# Altium project PCB_design_3.PrjPcb
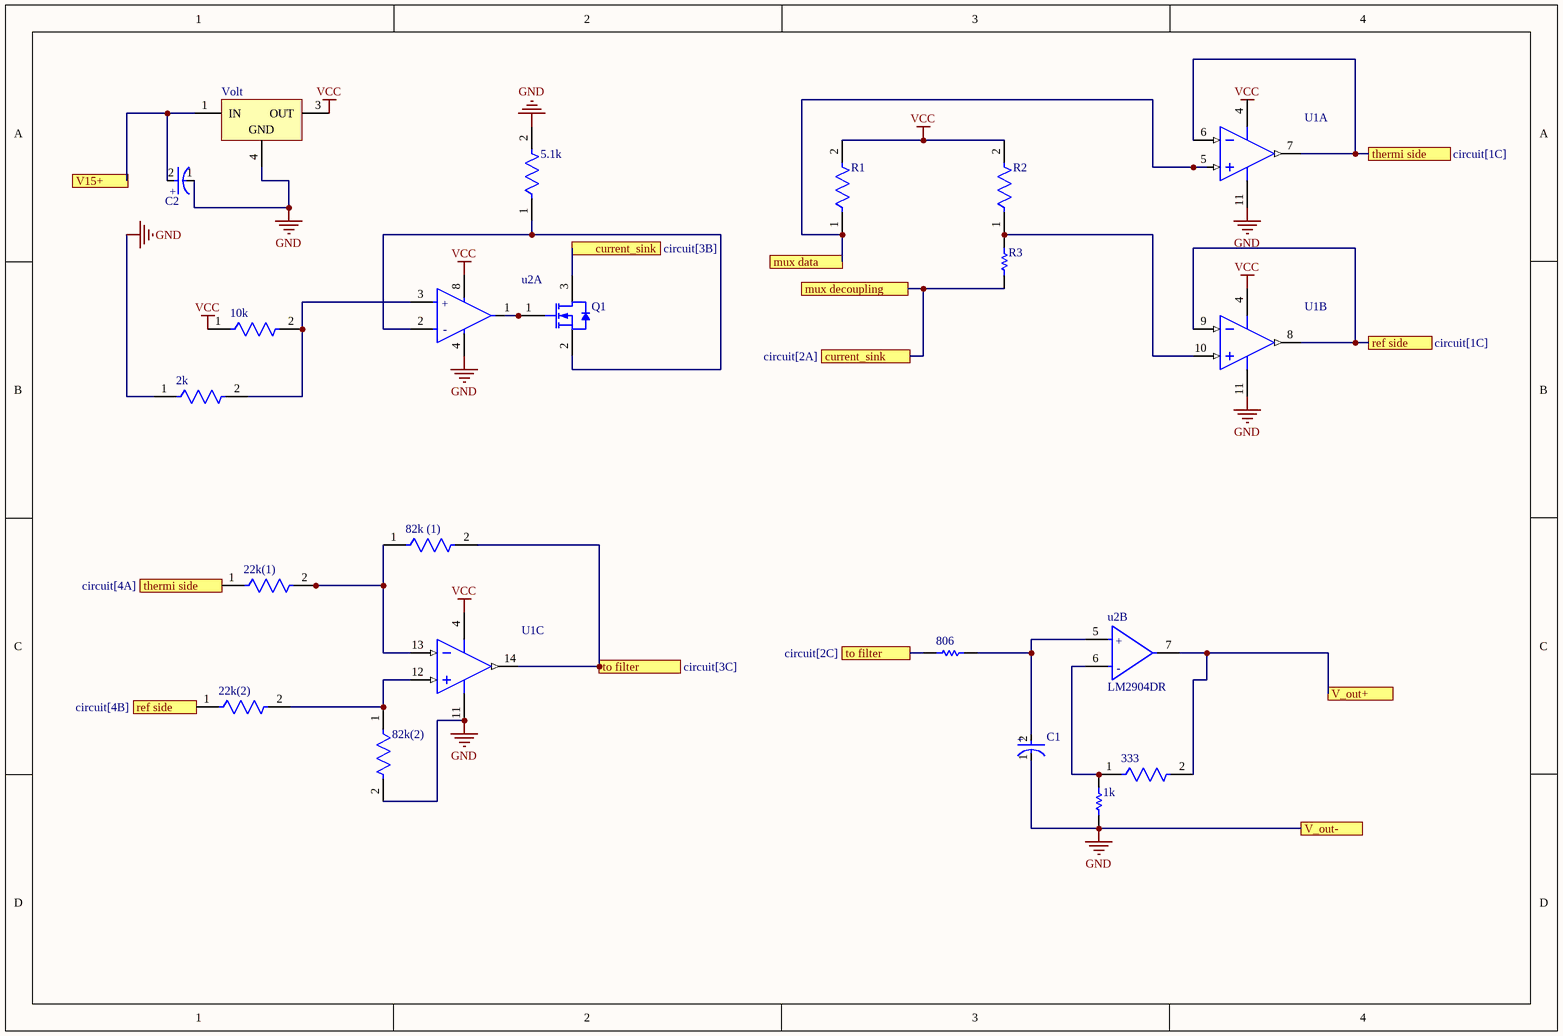
[diagram p0: circuit.SchDoc]
5 sheets, 94 parts. Net scope: flat (ports and power ports of the same name join across sheets).
Board files: circuit_pcb.PcbDoc, mounting_pcb.PcbDoc
Sheets:
  circuit.SchDoc
  mounting_circuit.SchDoc
  mounting_circuit(2).SchDoc
  mounting_circuit(3).SchDoc
  mounting_circuit(4).SchDoc

## Sheet circuit.SchDoc
size A4; SheetNumber: 1; SheetTotal: 5

### Parts
1k  CRCW12101K00FKEAHP  [RESC3225X60X45NL20T20]  (value not drawn)
2k  CRCW12062K00FKEA  [FP-CRCW1206-e3-IPC_A]  (value not drawn)
5.1k  CRCW12065K10FKEA  [FP-CRCW1206-e3-IPC_C]  (value not drawn)
10k  CRCW120610K0FKEA  [FP-CRCW1206-e3-IPC_C]  (value not drawn)
22k(1)  CRCW120622K0FKEA  [FP-CRCW1206-e3-IPC_A]  (value not drawn)
22k(2)  CRCW120622K0FKEA  [FP-CRCW1206-e3-IPC_A]  (value not drawn)
82k(2)  CRCW120682K0FKEA  [FP-CRCW1206-e3-IPC_B]  (value not drawn)
82k_(1)  CRCW120682K0FKEA  [FP-CRCW1206-e3-IPC_B]  (value not drawn)
333  CRCW0603330RFKEAHP  [FP-CRCW0603-HPe3-IPC_C]  (value not drawn)
806  RC1206FR-07806RL  [RESC3116X65X40NL10T20]  (value not drawn)
C1  TAJA106K016RNJ  [FP-TAJA-MFG]  (value not drawn)
C2  TAJA106K016RNJ  [FP-TAJA-MFG]  (value not drawn)
Q1  MGSF1N02LT1G  [ONSC-SOT-23-3-318-08_V]  (value not drawn)
R1  CRCW080540K0FKEA  [FP-CRCW0805-e3-MFG]  (value not drawn)
R2  CRCW080540K0FKEA  [FP-CRCW0805-e3-MFG]  (value not drawn)
R3  CRCW120615K0FKEA  [RESC3216X60X45LL10T20]  (value not drawn)
U1  LMH6683MA/NOPB  [D0014A_M]  (value not drawn)  (parts A,B,C of 4)
u2  LM2904DR  [FP-D0008A-MFG]  (value not drawn)  (parts A,B of 2)
Volt  L7812CD2T-TR  [TO-263_M]  (value not drawn)

### Ports
current_sink (see circuit[2A]), current_sink (see circuit[3B]), mux data, mux decoupling, ref side (see circuit[1C]), ref side (see circuit[4B]), thermi side (see circuit[1C]), thermi side (see circuit[4A]), to filter (see circuit[2C]), to filter (see circuit[3C]), V15+, V_out+, V_out-

### Nets
GND: 1k.1 2k.1 5.1k.2 82k(2).2 C1.1(C) C2.1(C) U1.11(V-) u2.4(V-) Volt.4(GND) ; port V_out-
VCC: 10k.1 R1.2 R2.2 U1.4(V+) u2.8(V+) Volt.3(OUT)
Net1k_2: 1k.2 333.1 u2.6(IN2-)
Net2k_2: 2k.2 10k.2 u2.3(IN1+)
Net5.1k_1: 5.1k.1 Q1.2(S) u2.2(IN1-)
Net22k(1)_1: 22k(1).1 U1.6(IN1-) U1.7(OUT1) ; port thermi side
Net22k(1)_2: 22k(1).2 82k_(1).1 U1.13(IN3-)
Net22k(2)_1: 22k(2).1 U1.8(OUT2) U1.9(IN2-) ; port ref side
Net22k(2)_2: 22k(2).2 82k(2).1 U1.12(IN3+)
Net82k_(1)_2: 82k_(1).2 806.1 U1.14(OUT3) ; port to filter
Net333_2: 333.2 u2.7(OUT2) ; port V_out+
Net806_2: 806.2 C1.2(A) u2.5(IN2+)
NetC2_2: C2.2(A) Volt.1(IN)
NetQ1_1: Q1.1(G) u2.1(OUT1)
NetQ1_3: Q1.3(D) R3.1 ; port current_sink, port mux decoupling
NetR1_1: R1.1 U1.5(IN1+) ; port mux data
NetR2_1: R2.1 R3.2 U1.10(IN2+)

### Notes on the sheet
- Labels drawn without touching a wire or pin: VCC
- (in symbol CMP-1661-00004-2) +
- (in symbol CMP-04895-000052-2, part A) +; -
- (in symbol CMP-04895-000052-2, part B) +; -

### Library data of the parts
1k = CMP-2005-00195-1: Manufacturer: Vishay Dale; Part Number: CRCW12101K00FKEAHP
2k = CMP-1014-00542-3: RES Thick Film, 2kΩ, 1%, 0.25W, 100ppm/°C, 1206; Max Power Dissipation: 250mW; Voltage Rating: 200V; Resistance: 2kR; Package Quantity: 10; Height: 0.55mm; Tolerance: 1%; Number of Terminations: 2; Mount: Surface Mount; Width: 1.6mm; Length: 3.2mm; Features: Automotive AEC-Q200; Contact Plating: Tin; Number of Pins: 2; Weight: 0.000353oz; Max Operating Temperature: 155°C; Min Operating Temperature: -55°C; Termination: SMD/SMT; Temperature Coefficient: 100ppm/°C; Case Code (Imperial): 1206; Depth: 1.6mm; Military Standard: Not; Case Code (Metric): 3216; Composition: Thick Film; Power Rating: 250mW; Case/Package: 1206; Radiation Hardening: No; Packaging: Tape and Reel
5.1k = CMP-1014-00590-3: RES Thick Film, 5.1kΩ, 1%, 0.25W, 100ppm/°C, 1206; Voltage Rating (DC): 200V; Max Power Dissipation: 250mW; Resistance: 5.1kR; Features: Automotive AEC-Q200; Weight: 0.000353oz; Case Code (Imperial): 1206; Case/Package: 1206; Min Operating Temperature: -55°C; Max Operating Temperature: 155°C; Height: 0.55mm; Termination: SMD/SMT; Case Code (Metric): 3216; Power Rating: 250mW; Lead Free: Lead Free; Contact Plating: Tin; Tolerance: 1%; Depth: 1.6mm; Composition: Thick Film; Radiation Hardening: No; Military Standard: Not; Packaging: Tape and Reel; Width: 1.6mm; Voltage Rating: 200V; Package Quantity: 10; Temperature Coefficient: 100ppm/°C; Length: 3.2mm; Number of Terminations: 2
10k = CMP-2003-04807-2: RES Thick Film, 10kΩ, 1%, 0.25W, 100ppm/°C, 1206; Working Voltage: 200V; Max Power Dissipation: 250mW; Resistance: 10kR; Tolerance: 1%; Width: 0.063inch; Height: 0.55mm; Number of Pins: 2; Voltage Rating: 200V; Temperature Coefficient: 100ppm/°C; Military Standard: Not; Features: Automotive AEC-Q200; Depth: 1.6mm; Radiation Hardening: No; Termination: SMD/SMT; Case Code (Imperial): 1206; Weight: 0.000353oz; Length: 3.2mm; Package Quantity: 10; Voltage Rating (DC): 200V; Case/Package: 1206; Min Operating Temperature: -55°C; Number of Terminations: 2; Composition: Thick Film; Contact Plating: Tin; Power Rating: 250mW; Packaging: Tape and Reel; Max Operating Temperature: 155°C; Lead Free: Lead Free; Case Code (Metric): 3216
22k(1) 22k(2) = CMP-2003-01962-2: RES Thick Film, 22kΩ, 1%, 0.25W, 100ppm/°C, 1206; Voltage Rating (DC): 200V; Resistance: 22kR; Max Power Dissipation: 250mW; Lead Free: Lead Free; Length: 3.2mm; Case Code (Imperial): 1206; Max Operating Temperature: 155°C; Packaging: Tape and Reel; Composition: Thick Film; Temperature Coefficient: 100ppm/°C; Contact Plating: Tin; Number of Terminations: 2; Case Code (Metric): 3216; Tolerance: 1%; Weight: 0.000353oz; Features: Automotive AEC-Q200; Min Operating Temperature: -55°C; Width: 0.063inch; Package Quantity: 10; Case/Package: 1206; Termination: SMD/SMT; Military Standard: Not; Depth: 1.6mm; Voltage Rating: 200V; Radiation Hardening: No; Power Rating: 250mW; Height: 0.55mm
82k(2) 82k_(1) = CMP-2003-02402-2: RES Thick Film, 82kΩ, 1%, 0.25W, 100ppm/°C, 1206; Max Power Dissipation: 250mW; Working Voltage: 200V; Resistance: 82kR; Temperature Coefficient: 100ppm/°C; Max Operating Temperature: 155°C; Depth: 1.6mm; Military Standard: Not; Case/Package: 1206; Number of Terminations: 2; Number of Pins: 2; Power Rating: 250mW; Packaging: Tape and Reel; Package Quantity: 10; Width: 0.063inch; Case Code (Imperial): 1206; Height: 0.55mm; Min Operating Temperature: -55°C; Termination: SMD/SMT; Tolerance: 1%; Voltage Rating (DC): 200V; Weight: 0.000353oz; Composition: Thick Film; Case Code (Metric): 3216; Contact Plating: Tin; Radiation Hardening: No; Lead Free: Lead Free; Voltage Rating: 200V; Features: Automotive AEC-Q200; Length: 3.2mm
333 = CMP-02407-011024-1: RES Thick Film, 330Ω, 1%, 0.33W, 100ppm/°C, 0603; Voltage Rating (DC): 75V; Resistance: 330R; Max Power Dissipation: 250mW; Length: 1.6mm; Case/Package: 0603; Depth: 0.85mm; Contact Plating: Tin; Resistor Type: Thick Film; Number of Terminations: 2; Height: 0.45mm; Radiation Hardening: No; Case Code (Imperial): 0603; Width: 0.033inch; Packaging: Tape and Reel; Weight: 7.1E-05oz; Lead Free: Lead Free; Technology: THICK FILM; Features: Automotive AEC-Q200; Resistance Tolerance: 1%; Tolerance: 1%; Termination: SMD/SMT; Max Operating Temperature: 155°C; RoHS Compliant: Yes; Mount: Surface Mount; Power Rating: 250mW; Series: CRCW-HP; Military Standard: Not; Voltage Rating: 75V; Package Quantity: 1; Temperature Coefficient: 100ppm/°C; Construction: Rectangular; Case Code (Metric): 1608; Min Operating Temperature: -55°C
806 = CMP-2003-03876-1: Manufacturer: Yageo; Part Number: RC1206FR-07806RL
C1 C2 = CMP-1661-00004-2: 10uF 16V  ±10% 3Ω 1206  SMD Tantalum Capacitor; ESR (Equivalent Series Resistance): 3R; Leakage Current: 1.6uA; Dissipation Factor: 8%; Polarity: Polar; Length: 3.2mm; Features: General Purpose; Voltage Rating: 16V; Voltage: 16V; Mount: Surface Mount; Case/Package: 1206; Number of Pins: 2; Case Code (Metric): 3216; Radiation Hardening: No; Min Operating Temperature: -55°C; Case Code (Imperial): 1206; Height - Seated (Max): 0.071inch; Lead Free: Lead Free; Termination: SMD/SMT; Dielectric Material: Tantalum; Width: 1.6mm; Tolerance: 10%; Capacitance: 10uF; Lead Pitch: 1.1mm; Max Operating Temperature: 125°C; Voltage Rating (DC): 16V; Packaging: Tape and Reel; Package Quantity: 1; REACH SVHC: No SVHC; Depth: 1.6mm; Height: 1.6mm
Q1 = CMP-1058-00777-1: Power MOSFET, 750 mA, 20 V, N-Channel, 3-Pin SOT-23, Pb-Free, Tape and Reel; Manufacturer: On Semiconductor; Crss Typ (pF): 45; Ciss Typ (pF): 125; VGS(th) Max (V): 2.4; Coss Typ (pF): 120; PD Max (W): 0.4; VGS Max (V): 20; Configuration: Single; Channel Polarity: N Channel; ID Max (A): 0.75; PackageReference: SOT-23-3-318-08; ComponentLink2Description: Datasheet; PackageVersion: Rev. AP, 11/2009; ComponentLink1URL: http://www.onsemi.com/; RoHS: Pb-Free; Mounting Technology: Surface Mount; Package Type: SOT-23-3; ComponentLink1Description: Manufacturer URL; V(BR)DSS Min (V): 20; PackageDescription: 3-Pin Small Outline Transistor, Body 2.92 x 1.3 mm, Pitch 0.95 mm; Packing: Tape and Reel; PartNumber: MGSF1N02LT1G; DatasheetVersion: Rev. 6; ComponentLink2URL: http://www.onsemi.cn/pub_link/Collateral/MGSF1N02LT1-D.PDF; ComponentLink3URL: http://www.onsemi.cn/pub_link/Collateral/318-08.PDF; ComponentLink3Description: Package Specification
R1 R2 = CMP-02407-003498-1: RES Thick Film, 40kΩ, 1%, 0.125W, 100ppm/°C, 0805; Resistance: 40kR; Max Power Dissipation: 125mW; Tolerance: 1%; Features: Automotive AEC-Q200; Max Operating Temperature: 155°C; Composition: Thick Film; Length: 0.079inch; Case/Package: 0805; Min Operating Temperature: -55°C; Packaging: Tape and Reel; Number of Terminations: 2; Width: 0.049inch; Height: 0.02inch; Package Quantity: 5000; Lead Free: Lead Free; Temperature Coefficient: 100ppm/°C
R3 = CMP-2003-01817-1: Manufacturer: Vishay Dale; Part Number: CRCW120615K0FKEA
U1 = CMP-0055-00500-3: 190MHz Single Supply, Dual and Triple Operational Amplifiers, 14-pin Narrow SOIC, Pb-Free; Manufacturer: Texas Instruments; PowerWise: N; PackageTopMarking: NSUZXYTTE#*LMH66*83MA; ComponentLink1Description: Datasheet URL; Package Reference: D0014A; PackageDescription: Molded Package S.O., .150in Wide, 14 Lead; CompType: Amplifiers; Code_JEDEC: MS-012AB; RoHS: Y; Code_IPC: SOIC127P600-14; ComponentLink1URL: http://www.ti.com/general/docs/lit/getliterature.tsp?genericPartNumber=LMH6683&fileType=pdf; PinCount: 14
u2 = CMP-04895-000052-2: IC OPAMP GP 2 CIRCUIT 8SOIC; Manufacturer: Texas Instruments; Max Supply Voltage: 26V; Nominal Supply Current: 350-500uA; Number Of Channels: 2; Input Offset Voltage: 3mV; Max Dual Supply Voltage: 13V; Max Junction Temp: +150°C; Voltage Gain: 100V/mV; Standoff Height: 0.11mm; Output Current Per Channel: 20mA; Gain Bandwidth: 0.7MHz; Min Dual Supply Voltage: 1.5V; Input Bias Current: -0.02uA; Min Supply Voltage: 3V; RoHS: TRUE; ComponentLink2URL: https://www.ti.com/lit/ds/symlink/lm2904.pdf; Category: IC; Ambient Temperature Range High: +125°C; Digikey Description: IC OPAMP GP 2 CIRCUIT 8SOIC; Automotive: No; Temperature Range High: +125°C; ComponentLink2Description: Datasheet; Mouser Description: Operational Amplifiers - Op Amps Dual GP Op Amp; Lead Free: Yes; Temperature: -40°C to +125°C; Manufacturer Part Number: LM2904DR; Device Class L3: Amplifiers - Op Amps; Device Class L2: Linear ICs; Device Class L1: Integrated Circuits (ICs); Package: D0008A; Octopart: https://octopart.com/lm2904dr-texas+instruments-409181; Height: 1.75mm; Ambient Temperature Range Low: -40°C; Temperature Range Low: -40°C
Volt = CMP-0244-00182-1: Positive Voltage Regulator, 3-Pin D2PAK, Tape and Reel; PackageDescription: 3-Pin Transistor Outline Package 2.54 mm Pitch, 15.4 mm Lead Span (D2PAK); ComponentLink1Description: Manufacturer URL; PackageReference: TO-263; DatasheetVersion: 16/11/2011; ComponentLink2URL: http://www.st.com/internet/com/TECHNICAL_RESOURCES/TECHNICAL_LITERATURE/DATASHEET/CD00000444.pdf; ComponentLink1URL: http://www.st.com; PackageVersion: 2011; ComponentLink2Description: Datasheet

## Sheet mounting_circuit.SchDoc
size A4; SheetNumber: 2; SheetTotal: 5
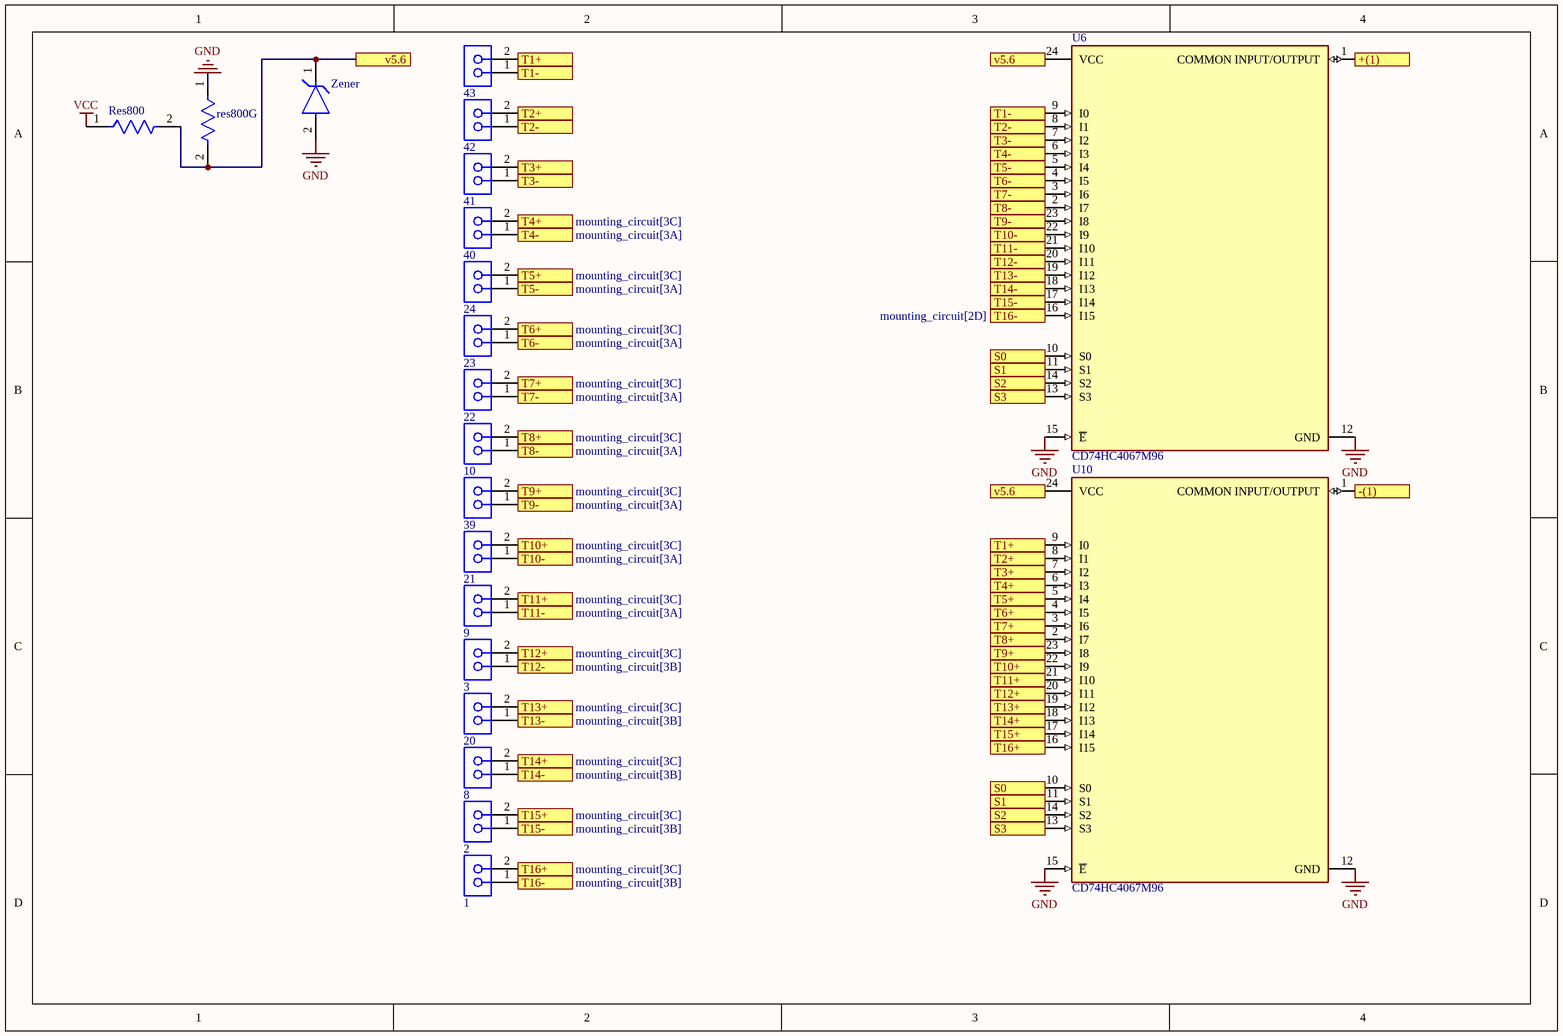
[diagram p1: mounting_circuit.SchDoc]

### Parts
1  Comment  [SMTC-SSW-102-02-X-S]  (value not drawn)
2  Comment  [SMTC-SSW-102-02-X-S]  (value not drawn)
3  Comment  [SMTC-SSW-102-02-X-S]  (value not drawn)
8  Comment  [SMTC-SSW-102-02-X-S]  (value not drawn)
9  1  [SMTC-SSW-102-02-X-S]  (value not drawn)
10  Comment  [SMTC-SSW-102-02-X-S]  (value not drawn)
20  Comment  [SMTC-SSW-102-02-X-S]  (value not drawn)
21  Comment  [SMTC-SSW-102-02-X-S]  (value not drawn)
22  Comment  [SMTC-SSW-102-02-X-S]  (value not drawn)
23  Comment  [SMTC-SSW-102-02-X-S]  (value not drawn)
24  0  [SMTC-SSW-102-02-X-S]  (value not drawn)
39  Comment  [SMTC-SSW-102-02-X-S]  (value not drawn)
40  0  [SMTC-SSW-102-02-X-S]  (value not drawn)
41  Comment  [SMTC-SSW-102-02-X-S]  (value not drawn)
42  Comment  [SMTC-SSW-102-02-X-S]  (value not drawn)
43  Comment  [SMTC-SSW-102-02-X-S]  (value not drawn)
Res800  MCA12060D8000BP500  [FP-MCA1206-IPC_C]  (value not drawn)
res800G  MCA12060D8000BP500  [FP-MCA1206-IPC_C]  (value not drawn)
U6  CD74HC4067M96  [FP-DW0024A-MFG]
U10  CD74HC4067M96  [FP-DW0024A-MFG]
Zener  MM3Z5V6ST1G  [FP-477-02-MFG]  (value not drawn)

### Ports
+(1), -(1), S0 (see mounting_circuit(2)[2B], mounting_circuit(2)[2D], mounting_circuit(3)[2B], mounting_circuit(3)[2D], mounting_circuit[3B]), S0 (see mounting_circuit(2)[2B], mounting_circuit(2)[2D], mounting_circuit(3)[2B], mounting_circuit(3)[2D], mounting_circuit[3D]), S1 (see mounting_circuit(2)[2B], mounting_circuit(2)[2D], mounting_circuit(3)[2B], mounting_circuit(3)[2D], mounting_circuit[3B]), S1 (see mounting_circuit(2)[2B], mounting_circuit(2)[2D], mounting_circuit(3)[2B], mounting_circuit(3)[2D], mounting_circuit[3D]), S2 (see mounting_circuit(2)[2B], mounting_circuit(2)[2D], mounting_circuit(3)[2B], mounting_circuit(3)[2D], mounting_circuit[3B]), S2 (see mounting_circuit(2)[2B], mounting_circuit(2)[2D], mounting_circuit(3)[2B], mounting_circuit(3)[2D], mounting_circuit[3D]), S3 (see mounting_circuit(2)[2B], mounting_circuit(2)[2D], mounting_circuit(3)[2B], mounting_circuit(3)[2D], mounting_circuit[3B]), S3 (see mounting_circuit(2)[2B], mounting_circuit(2)[2D], mounting_circuit(3)[2B], mounting_circuit(3)[2D], mounting_circuit[3D]), T1+ (see mounting_circuit[2A]), T1+ (see mounting_circuit[3C]), T1- (see mounting_circuit[2A]), T1- (see mounting_circuit[3A]), T2+ (see mounting_circuit[2A]), T2+ (see mounting_circuit[3C]), T2- (see mounting_circuit[2A]), T2- (see mounting_circuit[3A]), T3+ (see mounting_circuit[2A]), T3+ (see mounting_circuit[3C]), T3- (see mounting_circuit[2A]), T3- (see mounting_circuit[3A]), T4+ (see mounting_circuit[2A]), T4+ (see mounting_circuit[3C]), T4- (see mounting_circuit[2A]), T4- (see mounting_circuit[3A]), T5+ (see mounting_circuit[2B]), T5+ (see mounting_circuit[3C]), T5- (see mounting_circuit[2B]), T5- (see mounting_circuit[3A]), T6+ (see mounting_circuit[2B]), T6+ (see mounting_circuit[3C]), T6- (see mounting_circuit[2B]), T6- (see mounting_circuit[3A]), T7+ (see mounting_circuit[2B]), T7+ (see mounting_circuit[3C]), T7- (see mounting_circuit[2B]), T7- (see mounting_circuit[3A]), T8+ (see mounting_circuit[2B]), T8+ (see mounting_circuit[3C]), T8- (see mounting_circuit[2B]), T8- (see mounting_circuit[3A]), T9+ (see mounting_circuit[2B]), T9+ (see mounting_circuit[3C]), T9- (see mounting_circuit[2B]), T9- (see mounting_circuit[3A]), T10+ (see mounting_circuit[2C]), T10+ (see mounting_circuit[3C]), T10- (see mounting_circuit[2C]), T10- (see mounting_circuit[3A]), T11+ (see mounting_circuit[2C]), T11+ (see mounting_circuit[3C]), T11- (see mounting_circuit[2C]), T11- (see mounting_circuit[3A]), T12+ (see mounting_circuit[2C]), T12+ (see mounting_circuit[3C]), T12- (see mounting_circuit[2C]), T12- (see mounting_circuit[3B]), T13+ (see mounting_circuit[2C]), T13+ (see mounting_circuit[3C]), T13- (see mounting_circuit[2C]), T13- (see mounting_circuit[3B]), T14+ (see mounting_circuit[2C]), T14+ (see mounting_circuit[3C]), T14- (see mounting_circuit[2D]), T14- (see mounting_circuit[3B]), T15+ (see mounting_circuit[2D]), T15+ (see mounting_circuit[3C]), T15- (see mounting_circuit[2D]), T15- (see mounting_circuit[3B]), T16+ (see mounting_circuit[2D]), T16+ (see mounting_circuit[3C]), T16- (see mounting_circuit[2D]), T16- (see mounting_circuit[3B]), v5.6 (see mounting_circuit(2)[2A], mounting_circuit(2)[2C], mounting_circuit(3)[2A], mounting_circuit(3)[2C], mounting_circuit(4)[2A], mounting_circuit(4)[2C], mounting_circuit[1A], mounting_circuit[3A]), v5.6 (see mounting_circuit(2)[2A], mounting_circuit(2)[2C], mounting_circuit(3)[2A], mounting_circuit(3)[2C], mounting_circuit(4)[2A], mounting_circuit(4)[2C], mounting_circuit[1A], mounting_circuit[3B]), v5.6 (see mounting_circuit(2)[2A], mounting_circuit(2)[2C], mounting_circuit(3)[2A], mounting_circuit(3)[2C], mounting_circuit(4)[2A], mounting_circuit(4)[2C], mounting_circuit[3A], mounting_circuit[3B])

### Nets
GND: res800G.1 U6.12(GND) U6.15(~{E}) U10.12(GND) U10.15(~{E}) Zener.2(A)
VCC: Res800.1
Net1_1: 1.1 U6.16(I15) ; port T16-
Net1_2: 1.2 U10.16(I15) ; port T16+
Net2_1: 2.1 U6.17(I14) ; port T15-
Net2_2: 2.2 U10.17(I14) ; port T15+
Net3_1: 3.1 U6.20(I11) ; port T12-
Net3_2: 3.2 U10.20(I11) ; port T12+
Net8_1: 8.1 U6.18(I13) ; port T14-
Net8_2: 8.2 U10.18(I13) ; port T14+
Net9_1: 9.1 U6.21(I10) ; port T11-
Net9_2: 9.2 U10.21(I10) ; port T11+
Net10_1: 10.1 U6.2(I7) ; port T8-
Net10_2: 10.2 U10.2(I7) ; port T8+
Net20_1: 20.1 U6.19(I12) ; port T13-
Net20_2: 20.2 U10.19(I12) ; port T13+
Net21_1: 21.1 U6.22(I9) ; port T10-
Net21_2: 21.2 U10.22(I9) ; port T10+
Net22_1: 22.1 U6.3(I6) ; port T7-
Net22_2: 22.2 U10.3(I6) ; port T7+
Net23_1: 23.1 U6.4(I5) ; port T6-
Net23_2: 23.2 U10.4(I5) ; port T6+
Net24_1: 24.1 U6.5(I4) ; port T5-
Net24_2: 24.2 U10.5(I4) ; port T5+
Net39_1: 39.1 U6.23(I8) ; port T9-
Net39_2: 39.2 U10.23(I8) ; port T9+
Net40_1: 40.1 U6.6(I3) ; port T4-
Net40_2: 40.2 U10.6(I3) ; port T4+
Net41_1: 41.1 U6.7(I2) ; port T3-
Net41_2: 41.2 U10.7(I2) ; port T3+
Net42_1: 42.1 U6.8(I1) ; port T2-
Net42_2: 42.2 U10.8(I1) ; port T2+
Net43_1: 43.1 U6.9(I0) ; port T1-
Net43_2: 43.2 U10.9(I0) ; port T1+
NetRes800_2: Res800.2 res800G.2 U6.24(VCC) U10.24(VCC) Zener.1(C) ; port v5.6
NetU4_10: U6.10(S0) U10.10(S0) ; port S0
NetU4_11: U6.11(S1) U10.11(S1) ; port S1
NetU4_13: U6.13(S3) U10.13(S3) ; port S3
NetU4_14: U6.14(S2) U10.14(S2) ; port S2
NetU6_1: U6.1(COMMON_INPUT/OUTPUT) ; port +(1)
NetU10_1: U10.1(COMMON_INPUT/OUTPUT) ; port -(1)

### Library data of the parts
1-3 8-10 20-24 39-43 = CMP-1023-00323-1: SQ Post Socket, Through-hole, Vertical, -55 to 105 degC, 2.54 mm Pitch, 2-Pin, Female, RoHS; Manufacturer: Samtec; PartNumber: SSW-102-02-T-S; Pitch: 2.54 mm; ComponentLink3Description: Package Specification; ComponentLink2Description: Datasheet; ComponentLink1Description: Manufacturer URL; PackageVersion: CA, 6/1987; DatasheetVersion: F-214; PackageDescription: Assembly, Socket Strip .016 X .031 Tail; ComponentLink2URL: http://www.samtec.com/documents/webfiles/pdf/SSW_TH.PDF; RoHS: True; ComponentLink3URL: http://www.samtec.com/documents/webfiles/cpdf/SSW-1XX-XX-XXX-X-XX-XXX-XX-MKT.pdf; ComponentLink1URL: http://www.samtec.com; PackageReference: SSW-102-02-X-S; Mounting Technology: Through-hole; Orientation: Vertical; Temperature Range: -55 to 105 degC
Res800 res800G = CMP-02407-008722-1: Res MC Precision Thin Film 1206 800Ω 0.1% 0.25W ±25ppm/°C Molded Paper T/R; Resistance: 800R; Max Power Dissipation: 250mW; Lead Free: Lead Free; Package Quantity: 5000; Composition: Thin Film; Tolerance: 0.1%; Number of Terminations: 2; Length: 0.126inch; Width: 0.063inch; Max Operating Temperature: 125°C; Packaging: Tape and Reel; Min Operating Temperature: -55°C; Case/Package: 1206; Temperature Coefficient: 25ppm/°C; Height: 0.026inch
U6 U10 = CMP-04901-000007-1: IC MUX/DEMUX 1X16 24SOIC; Manufacturer: Texas Instruments; Standoff Height: 0.1mm; Logic Function Desc: Non-Inverting; Max Supply Voltage: 6V; Number Of Inputs: 16; Quiescent Current: 8uA; Number Of Circuits: 1; Propagation Delay: 6ns; Max Junction Temp: +150°C; Min Supply Voltage: 2V; ComponentLink2Description: Datasheet; Octopart: https://octopart.com/cd74hc4067m96-texas+instruments-722802; Ambient Temperature Range High: +125°C; Ipc Land Pattern Name: SOIC127P1030X265-24; Height: 2.65mm; Mouser Description: Multiplexer Switch ICs Hi-Spd CMOS 16Ch Anl Mltplxr/Demltplxr; Temperature Range Low: -55°C; Package: DW0024A; Temperature Range High: +125°C; Lead Free: Yes; ComponentLink2URL: http://www.ti.com/lit/ds/symlink/cd74hc4067.pdf; Manufacturer Part Number: CD74HC4067M96; RoHS: TRUE; Automotive: No; Device Class L1: Integrated Circuits (ICs); Digikey Description: IC MUX/DEMUX 1X16 24SOIC; Device Class L2: Logic ICs; Temperature: -55°C to +125°C; Device Class L3: Multiplexers; Category: IC; Ambient Temperature Range Low: -55°C; Number Of Outputs: 1
Zener = CMP-1060-00706-2: DIODE ZENER 5.6V 300MW SOD323; Test Current: 5mA; Power Rating: 200mW; ESD Protection: Yes; Peak Reverse Current: 1uA; Voltage Tolerance: 2%; Forward Voltage: 900mV; Impedance: 40R; Element Configuration: Single; Zener Current: 10mA; Length: 1.8mm; Package Quantity: 1; Contact Plating: Tin; Number of Pins: 2; Case/Package: SOD-323-2; Max Power Dissipation: 200mW; Lead Free: Lead Free; Radiation Hardening: No; Width: 1.35mm; REACH SVHC: No SVHC; Zener Voltage: 5.6V; Height: 1mm; Max Reverse Leakage Current: 1uA; Packaging: Tape and Reel; Min Operating Temperature: -65°C; Voltage Rating (DC): 5.6V; Power Dissipation: 200mW; Max Operating Temperature: 150°C; Working Voltage: 5.6V; Material: Plastic; Tolerance: 2%

## Sheet mounting_circuit(2).SchDoc
size A4; SheetNumber: 3; SheetTotal: 5
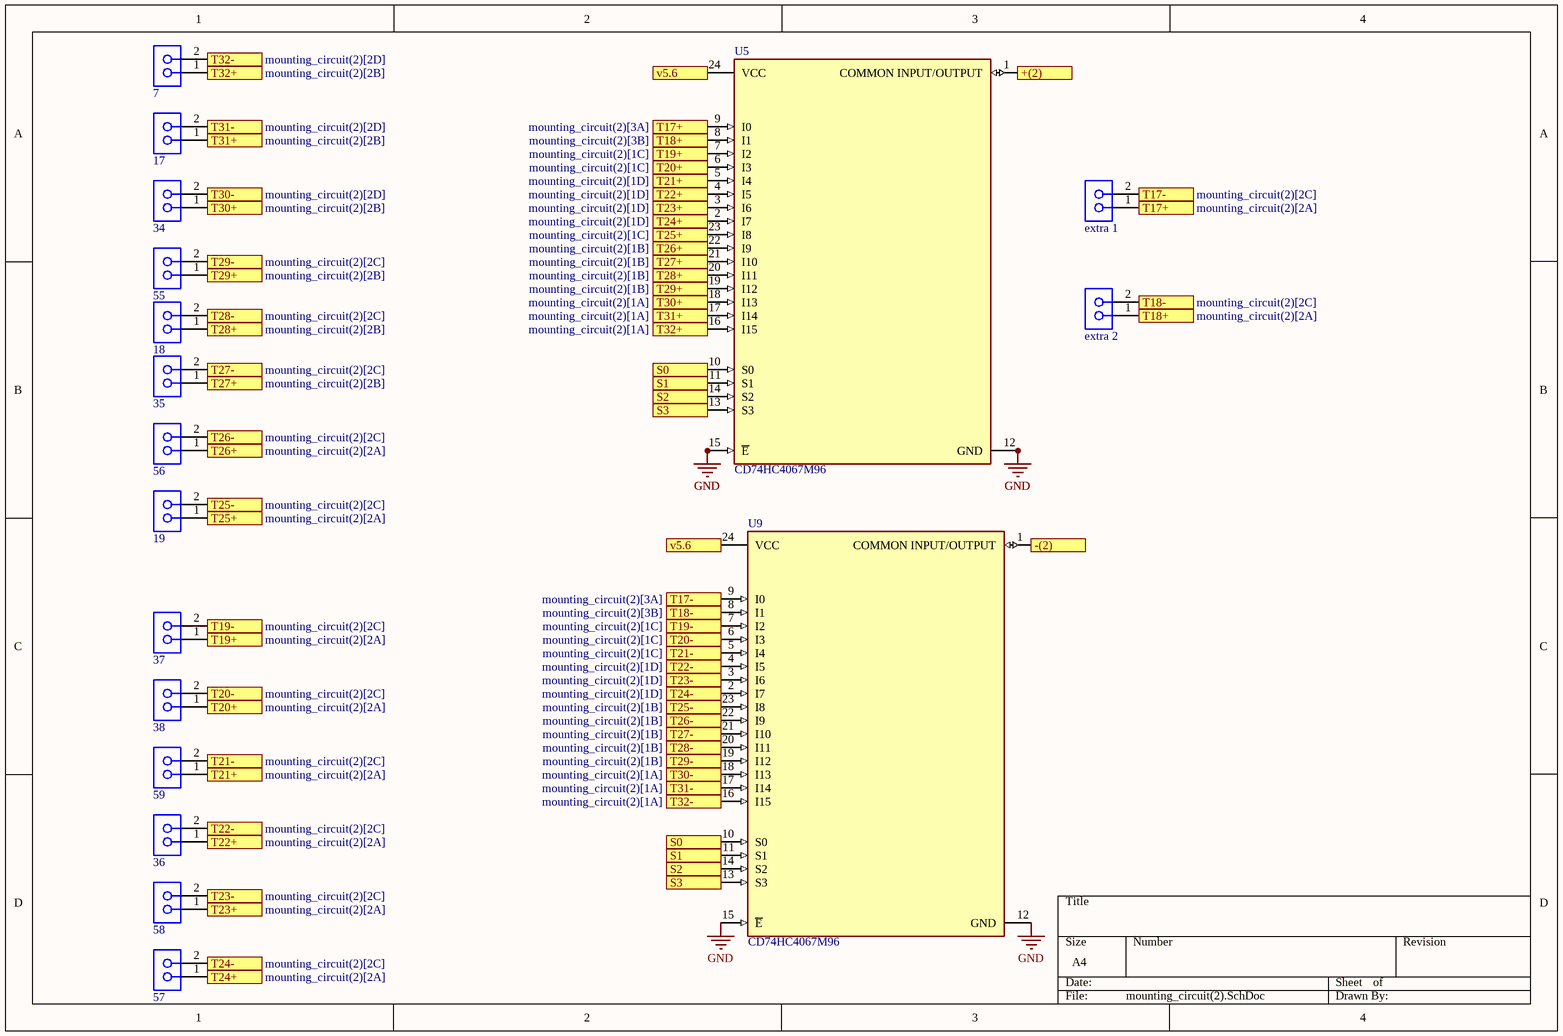
[diagram p2: mounting_circuit(2).SchDoc]

### Parts
7  Comment  [SMTC-SSW-102-02-X-S]  (value not drawn)
17  Comment  [SMTC-SSW-102-02-X-S]  (value not drawn)
18  0  [SMTC-SSW-102-02-X-S]  (value not drawn)
19  Comment  [SMTC-SSW-102-02-X-S]  (value not drawn)
34  Comment  [SMTC-SSW-102-02-X-S]  (value not drawn)
35  Comment  [SMTC-SSW-102-02-X-S]  (value not drawn)
36  Comment  [SMTC-SSW-102-02-X-S]  (value not drawn)
37  Comment  [SMTC-SSW-102-02-X-S]  (value not drawn)
38  1  [SMTC-SSW-102-02-X-S]  (value not drawn)
55  0  [SMTC-SSW-102-02-X-S]  (value not drawn)
56  Comment  [SMTC-SSW-102-02-X-S]  (value not drawn)
57  Comment  [SMTC-SSW-102-02-X-S]  (value not drawn)
58  Comment  [SMTC-SSW-102-02-X-S]  (value not drawn)
59  Comment  [SMTC-SSW-102-02-X-S]  (value not drawn)
extra_1  Comment  [SMTC-SSW-102-02-X-S]  (value not drawn)
extra_2  Comment  [SMTC-SSW-102-02-X-S]  (value not drawn)
U5  CD74HC4067M96  [FP-DW0024A-MFG]
U9  CD74HC4067M96  [FP-DW0024A-MFG]

### Ports
+(2), -(2), S0 (see mounting_circuit(2)[2B], mounting_circuit(3)[2B], mounting_circuit(3)[2D], mounting_circuit[3B], mounting_circuit[3D]), S0 (see mounting_circuit(2)[2D], mounting_circuit(3)[2B], mounting_circuit(3)[2D], mounting_circuit[3B], mounting_circuit[3D]), S1 (see mounting_circuit(2)[2B], mounting_circuit(3)[2B], mounting_circuit(3)[2D], mounting_circuit[3B], mounting_circuit[3D]), S1 (see mounting_circuit(2)[2D], mounting_circuit(3)[2B], mounting_circuit(3)[2D], mounting_circuit[3B], mounting_circuit[3D]), S2 (see mounting_circuit(2)[2B], mounting_circuit(3)[2B], mounting_circuit(3)[2D], mounting_circuit[3B], mounting_circuit[3D]), S2 (see mounting_circuit(2)[2D], mounting_circuit(3)[2B], mounting_circuit(3)[2D], mounting_circuit[3B], mounting_circuit[3D]), S3 (see mounting_circuit(2)[2B], mounting_circuit(3)[2B], mounting_circuit(3)[2D], mounting_circuit[3B], mounting_circuit[3D]), S3 (see mounting_circuit(2)[2D], mounting_circuit(3)[2B], mounting_circuit(3)[2D], mounting_circuit[3B], mounting_circuit[3D]), T17+ (see mounting_circuit(2)[2A]), T17+ (see mounting_circuit(2)[3A]), T17- (see mounting_circuit(2)[2C]), T17- (see mounting_circuit(2)[3A]), T18+ (see mounting_circuit(2)[2A]), T18+ (see mounting_circuit(2)[3B]), T18- (see mounting_circuit(2)[2C]), T18- (see mounting_circuit(2)[3B]), T19+ (see mounting_circuit(2)[1C]), T19+ (see mounting_circuit(2)[2A]), T19- (see mounting_circuit(2)[1C]), T19- (see mounting_circuit(2)[2C]), T20+ (see mounting_circuit(2)[1C]), T20+ (see mounting_circuit(2)[2A]), T20- (see mounting_circuit(2)[1C]), T20- (see mounting_circuit(2)[2C]), T21+ (see mounting_circuit(2)[1D]), T21+ (see mounting_circuit(2)[2A]), T21- (see mounting_circuit(2)[1C]), T21- (see mounting_circuit(2)[2C]), T22+ (see mounting_circuit(2)[1D]), T22+ (see mounting_circuit(2)[2A]), T22- (see mounting_circuit(2)[1D]), T22- (see mounting_circuit(2)[2C]), T23+ (see mounting_circuit(2)[1D]), T23+ (see mounting_circuit(2)[2A]), T23- (see mounting_circuit(2)[1D]), T23- (see mounting_circuit(2)[2C]), T24+ (see mounting_circuit(2)[1D]), T24+ (see mounting_circuit(2)[2A]), T24- (see mounting_circuit(2)[1D]), T24- (see mounting_circuit(2)[2C]), T25+ (see mounting_circuit(2)[1C]), T25+ (see mounting_circuit(2)[2A]), T25- (see mounting_circuit(2)[1B]), T25- (see mounting_circuit(2)[2C]), T26+ (see mounting_circuit(2)[1B]), T26+ (see mounting_circuit(2)[2A]), T26- (see mounting_circuit(2)[1B]), T26- (see mounting_circuit(2)[2C]), T27+ (see mounting_circuit(2)[1B]), T27+ (see mounting_circuit(2)[2B]), T27- (see mounting_circuit(2)[1B]), T27- (see mounting_circuit(2)[2C]), T28+ (see mounting_circuit(2)[1B]), T28+ (see mounting_circuit(2)[2B]), T28- (see mounting_circuit(2)[1B]), T28- (see mounting_circuit(2)[2C]), T29+ (see mounting_circuit(2)[1B]), T29+ (see mounting_circuit(2)[2B]), T29- (see mounting_circuit(2)[1B]), T29- (see mounting_circuit(2)[2C]), T30+ (see mounting_circuit(2)[1A]), T30+ (see mounting_circuit(2)[2B]), T30- (see mounting_circuit(2)[1A]), T30- (see mounting_circuit(2)[2D]), T31+ (see mounting_circuit(2)[1A]), T31+ (see mounting_circuit(2)[2B]), T31- (see mounting_circuit(2)[1A]), T31- (see mounting_circuit(2)[2D]), T32+ (see mounting_circuit(2)[1A]), T32+ (see mounting_circuit(2)[2B]), T32- (see mounting_circuit(2)[1A]), T32- (see mounting_circuit(2)[2D]), v5.6 (see mounting_circuit(2)[2A], mounting_circuit(3)[2A], mounting_circuit(3)[2C], mounting_circuit(4)[2A], mounting_circuit(4)[2C], mounting_circuit[1A], mounting_circuit[3A], mounting_circuit[3B]), v5.6 (see mounting_circuit(2)[2C], mounting_circuit(3)[2A], mounting_circuit(3)[2C], mounting_circuit(4)[2A], mounting_circuit(4)[2C], mounting_circuit[1A], mounting_circuit[3A], mounting_circuit[3B])

### Nets
GND: U5.12(GND) U5.15(~{E}) U9.12(GND) U9.15(~{E})
Net7_1: 7.1 U5.16(I15) ; port T32+
Net7_2: 7.2 U9.16(I15) ; port T32-
Net17_1: 17.1 U5.17(I14) ; port T31+
Net17_2: 17.2 U9.17(I14) ; port T31-
Net18_1: 18.1 U5.20(I11) ; port T28+
Net18_2: 18.2 U9.20(I11) ; port T28-
Net19_1: 19.1 U5.23(I8) ; port T25+
Net19_2: 19.2 U9.23(I8) ; port T25-
Net34_1: 34.1 U5.18(I13) ; port T30+
Net34_2: 34.2 U9.18(I13) ; port T30-
Net35_1: 35.1 U5.21(I10) ; port T27+
Net35_2: 35.2 U9.21(I10) ; port T27-
Net36_1: 36.1 U5.4(I5) ; port T22+
Net36_2: 36.2 U9.4(I5) ; port T22-
Net37_1: 37.1 U5.7(I2) ; port T19+
Net37_2: 37.2 U9.7(I2) ; port T19-
Net38_1: 38.1 U5.6(I3) ; port T20+
Net38_2: 38.2 U9.6(I3) ; port T20-
Net55_1: 55.1 U5.19(I12) ; port T29+
Net55_2: 55.2 U9.19(I12) ; port T29-
Net56_1: 56.1 U5.22(I9) ; port T26+
Net56_2: 56.2 U9.22(I9) ; port T26-
Net57_1: 57.1 U5.2(I7) ; port T24+
Net57_2: 57.2 U9.2(I7) ; port T24-
Net58_1: 58.1 U5.3(I6) ; port T23+
Net58_2: 58.2 U9.3(I6) ; port T23-
Net59_1: 59.1 U5.5(I4) ; port T21+
Net59_2: 59.2 U9.5(I4) ; port T21-
Netextra_1_1: extra_1.1 U5.9(I0) ; port T17+
Netextra_1_2: extra_1.2 U9.9(I0) ; port T17-
Netextra_2_1: extra_2.1 U5.8(I1) ; port T18+
Netextra_2_2: extra_2.2 U9.8(I1) ; port T18-
NetRes800_2: U5.24(VCC) U9.24(VCC) ; port v5.6
NetU4_10: U5.10(S0) U9.10(S0) ; port S0
NetU4_11: U5.11(S1) U9.11(S1) ; port S1
NetU4_13: U5.13(S3) U9.13(S3) ; port S3
NetU4_14: U5.14(S2) U9.14(S2) ; port S2
NetU5_1: U5.1(COMMON_INPUT/OUTPUT) ; port +(2)
NetU9_1: U9.1(COMMON_INPUT/OUTPUT) ; port -(2)

### Library data of the parts
7 17-19 34-38 55-59 extra_1 extra_2 = CMP-1023-00323-1: as 1 on sheet mounting_circuit; ComponentLink3Description: Package Specification; ComponentLink2Description: Datasheet; ComponentLink1Description: Manufacturer URL; PackageVersion: CA, 6/1987; DatasheetVersion: F-214; PackageDescription: Assembly, Socket Strip .016 X .031 Tail; ComponentLink2URL: http://www.samtec.com/documents/webfiles/pdf/SSW_TH.PDF; RoHS: True; ComponentLink3URL: http://www.samtec.com/documents/webfiles/cpdf/SSW-1XX-XX-XXX-X-XX-XXX-XX-MKT.pdf; ComponentLink1URL: http://www.samtec.com; PackageReference: SSW-102-02-X-S; Mounting Technology: Through-hole; Orientation: Vertical; Temperature Range: -55 to 105 degC
U5 U9 = CMP-04901-000007-1: as U6 on sheet mounting_circuit; ComponentLink2Description: Datasheet; Octopart: https://octopart.com/cd74hc4067m96-texas+instruments-722802; Ambient Temperature Range High: +125°C; Ipc Land Pattern Name: SOIC127P1030X265-24; Height: 2.65mm; Mouser Description: Multiplexer Switch ICs Hi-Spd CMOS 16Ch Anl Mltplxr/Demltplxr; Temperature Range Low: -55°C; Package: DW0024A; Temperature Range High: +125°C; Lead Free: Yes; ComponentLink2URL: http://www.ti.com/lit/ds/symlink/cd74hc4067.pdf; Manufacturer Part Number: CD74HC4067M96; RoHS: TRUE; Automotive: No; Device Class L1: Integrated Circuits (ICs); Digikey Description: IC MUX/DEMUX 1X16 24SOIC; Device Class L2: Logic ICs; Temperature: -55°C to +125°C; Device Class L3: Multiplexers; Category: IC; Ambient Temperature Range Low: -55°C; Number Of Outputs: 1

## Sheet mounting_circuit(3).SchDoc
size A4; SheetNumber: 4; SheetTotal: 5
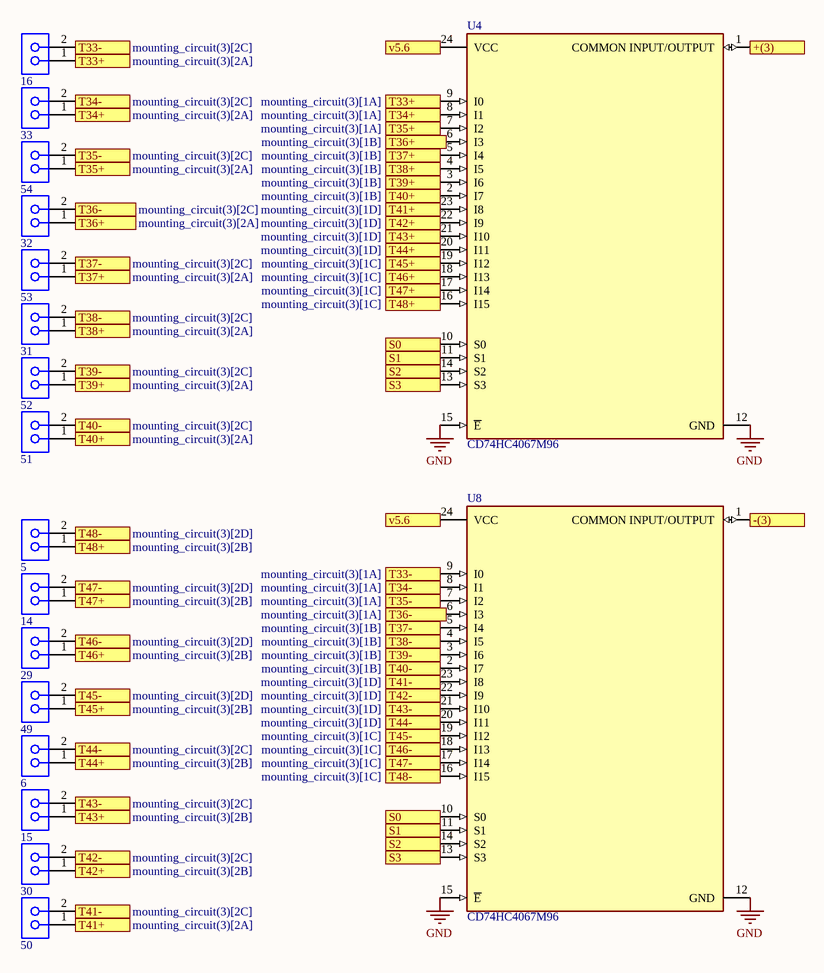
[diagram p3: mounting_circuit(3).SchDoc]

### Parts
5  Comment  [SMTC-SSW-102-02-X-S]  (value not drawn)
6  0  [SMTC-SSW-102-02-X-S]  (value not drawn)
14  Comment  [SMTC-SSW-102-02-X-S]  (value not drawn)
15  Comment  [SMTC-SSW-102-02-X-S]  (value not drawn)
16  Comment  [SMTC-SSW-102-02-X-S]  (value not drawn)
29  Comment  [SMTC-SSW-102-02-X-S]  (value not drawn)
30  Comment  [SMTC-SSW-102-02-X-S]  (value not drawn)
31  Comment  [SMTC-SSW-102-02-X-S]  (value not drawn)
32  Comment  [SMTC-SSW-102-02-X-S]  (value not drawn)
33  Comment  [SMTC-SSW-102-02-X-S]  (value not drawn)
49  0  [SMTC-SSW-102-02-X-S]  (value not drawn)
50  Comment  [SMTC-SSW-102-02-X-S]  (value not drawn)
51  1  [SMTC-SSW-102-02-X-S]  (value not drawn)
52  Comment  [SMTC-SSW-102-02-X-S]  (value not drawn)
53  Comment  [SMTC-SSW-102-02-X-S]  (value not drawn)
54  Comment  [SMTC-SSW-102-02-X-S]  (value not drawn)
U4  CD74HC4067M96  [FP-DW0024A-MFG]
U8  CD74HC4067M96  [FP-DW0024A-MFG]

### Ports
+(3), -(3), S0 (see mounting_circuit(2)[2B], mounting_circuit(2)[2D], mounting_circuit(3)[2B], mounting_circuit[3B], mounting_circuit[3D]), S0 (see mounting_circuit(2)[2B], mounting_circuit(2)[2D], mounting_circuit(3)[2D], mounting_circuit[3B], mounting_circuit[3D]), S1 (see mounting_circuit(2)[2B], mounting_circuit(2)[2D], mounting_circuit(3)[2B], mounting_circuit[3B], mounting_circuit[3D]), S1 (see mounting_circuit(2)[2B], mounting_circuit(2)[2D], mounting_circuit(3)[2D], mounting_circuit[3B], mounting_circuit[3D]), S2 (see mounting_circuit(2)[2B], mounting_circuit(2)[2D], mounting_circuit(3)[2B], mounting_circuit[3B], mounting_circuit[3D]), S2 (see mounting_circuit(2)[2B], mounting_circuit(2)[2D], mounting_circuit(3)[2D], mounting_circuit[3B], mounting_circuit[3D]), S3 (see mounting_circuit(2)[2B], mounting_circuit(2)[2D], mounting_circuit(3)[2B], mounting_circuit[3B], mounting_circuit[3D]), S3 (see mounting_circuit(2)[2B], mounting_circuit(2)[2D], mounting_circuit(3)[2D], mounting_circuit[3B], mounting_circuit[3D]), T33+ (see mounting_circuit(3)[1A]), T33+ (see mounting_circuit(3)[2A]), T33- (see mounting_circuit(3)[1A]), T33- (see mounting_circuit(3)[2C]), T34+ (see mounting_circuit(3)[1A]), T34+ (see mounting_circuit(3)[2A]), T34- (see mounting_circuit(3)[1A]), T34- (see mounting_circuit(3)[2C]), T35+ (see mounting_circuit(3)[1A]), T35+ (see mounting_circuit(3)[2A]), T35- (see mounting_circuit(3)[1A]), T35- (see mounting_circuit(3)[2C]), T36+ (see mounting_circuit(3)[1B]), T36+ (see mounting_circuit(3)[2A]), T36- (see mounting_circuit(3)[1A]), T36- (see mounting_circuit(3)[2C]), T37+ (see mounting_circuit(3)[1B]), T37+ (see mounting_circuit(3)[2A]), T37- (see mounting_circuit(3)[1B]), T37- (see mounting_circuit(3)[2C]), T38+ (see mounting_circuit(3)[1B]), T38+ (see mounting_circuit(3)[2A]), T38- (see mounting_circuit(3)[1B]), T38- (see mounting_circuit(3)[2C]), T39+ (see mounting_circuit(3)[1B]), T39+ (see mounting_circuit(3)[2A]), T39- (see mounting_circuit(3)[1B]), T39- (see mounting_circuit(3)[2C]), T40+ (see mounting_circuit(3)[1B]), T40+ (see mounting_circuit(3)[2A]), T40- (see mounting_circuit(3)[1B]), T40- (see mounting_circuit(3)[2C]), T41+ (see mounting_circuit(3)[1D]), T41+ (see mounting_circuit(3)[2A]), T41- (see mounting_circuit(3)[1D]), T41- (see mounting_circuit(3)[2C]), T42+ (see mounting_circuit(3)[1D]), T42+ (see mounting_circuit(3)[2B]), T42- (see mounting_circuit(3)[1D]), T42- (see mounting_circuit(3)[2C]), T43+ (see mounting_circuit(3)[1D]), T43+ (see mounting_circuit(3)[2B]), T43- (see mounting_circuit(3)[1D]), T43- (see mounting_circuit(3)[2C]), T44+ (see mounting_circuit(3)[1D]), T44+ (see mounting_circuit(3)[2B]), T44- (see mounting_circuit(3)[1D]), T44- (see mounting_circuit(3)[2C]), T45+ (see mounting_circuit(3)[1C]), T45+ (see mounting_circuit(3)[2B]), T45- (see mounting_circuit(3)[1C]), T45- (see mounting_circuit(3)[2D]), T46+ (see mounting_circuit(3)[1C]), T46+ (see mounting_circuit(3)[2B]), T46- (see mounting_circuit(3)[1C]), T46- (see mounting_circuit(3)[2D]), T47+ (see mounting_circuit(3)[1C]), T47+ (see mounting_circuit(3)[2B]), T47- (see mounting_circuit(3)[1C]), T47- (see mounting_circuit(3)[2D]), T48+ (see mounting_circuit(3)[1C]), T48+ (see mounting_circuit(3)[2B]), T48- (see mounting_circuit(3)[1C]), T48- (see mounting_circuit(3)[2D]), v5.6 (see mounting_circuit(2)[2A], mounting_circuit(2)[2C], mounting_circuit(3)[2A], mounting_circuit[1A], mounting_circuit[3A], mounting_circuit[3B]), v5.6 (see mounting_circuit(2)[2A], mounting_circuit(2)[2C], mounting_circuit(3)[2C], mounting_circuit[1A], mounting_circuit[3A], mounting_circuit[3B])

### Nets
GND: U4.12(GND) U4.15(~{E}) U8.12(GND) U8.15(~{E})
Net5_1: 5.1 U4.16(I15) ; port T48+
Net5_2: 5.2 U8.16(I15) ; port T48-
Net6_1: 6.1 U4.20(I11) ; port T44+
Net6_2: 6.2 U8.20(I11) ; port T44-
Net14_1: 14.1 U4.17(I14) ; port T47+
Net14_2: 14.2 U8.17(I14) ; port T47-
Net15_1: 15.1 U4.21(I10) ; port T43+
Net15_2: 15.2 U8.21(I10) ; port T43-
Net16_1: 16.1 U4.9(I0) ; port T33+
Net16_2: 16.2 U8.9(I0) ; port T33-
Net29_1: 29.1 U4.18(I13) ; port T46+
Net29_2: 29.2 U8.18(I13) ; port T46-
Net30_1: 30.1 U4.22(I9) ; port T42+
Net30_2: 30.2 U8.22(I9) ; port T42-
Net31_1: 31.1 U4.4(I5) ; port T38+
Net31_2: 31.2 U8.4(I5) ; port T38-
Net32_1: 32.1 ; port T36+
Net32_2: 32.2 ; port T36-
Net33_1: 33.1 U4.8(I1) ; port T34+
Net33_2: 33.2 U8.8(I1) ; port T34-
Net49_1: 49.1 U4.19(I12) ; port T45+
Net49_2: 49.2 U8.19(I12) ; port T45-
Net50_1: 50.1 U4.23(I8) ; port T41+
Net50_2: 50.2 U8.23(I8) ; port T41-
Net51_1: 51.1 U4.2(I7) ; port T40+
Net51_2: 51.2 U8.2(I7) ; port T40-
Net52_1: 52.1 U4.3(I6) ; port T39+
Net52_2: 52.2 U8.3(I6) ; port T39-
Net53_1: 53.1 U4.5(I4) ; port T37+
Net53_2: 53.2 U8.5(I4) ; port T37-
Net54_1: 54.1 U4.7(I2) ; port T35+
Net54_2: 54.2 U8.7(I2) ; port T35-
NetRes800_2: U4.24(VCC) U8.24(VCC) ; port v5.6
NetU4_1: U4.1(COMMON_INPUT/OUTPUT) ; port +(3)
NetU4_10: U4.10(S0) U8.10(S0) ; port S0
NetU4_11: U4.11(S1) U8.11(S1) ; port S1
NetU4_13: U4.13(S3) U8.13(S3) ; port S3
NetU4_14: U4.14(S2) U8.14(S2) ; port S2
NetU8_1: U8.1(COMMON_INPUT/OUTPUT) ; port -(3)

Not connected (* = marked no-connect by the designer): U4 6(I3); U8 6(I3)

### Library data of the parts
5 6 14-16 29-33 49-54 = CMP-1023-00323-1: as 1 on sheet mounting_circuit; ComponentLink3Description: Package Specification; ComponentLink2Description: Datasheet; ComponentLink1Description: Manufacturer URL; PackageVersion: CA, 6/1987; DatasheetVersion: F-214; PackageDescription: Assembly, Socket Strip .016 X .031 Tail; ComponentLink2URL: http://www.samtec.com/documents/webfiles/pdf/SSW_TH.PDF; RoHS: True; ComponentLink3URL: http://www.samtec.com/documents/webfiles/cpdf/SSW-1XX-XX-XXX-X-XX-XXX-XX-MKT.pdf; ComponentLink1URL: http://www.samtec.com; PackageReference: SSW-102-02-X-S; Mounting Technology: Through-hole; Orientation: Vertical; Temperature Range: -55 to 105 degC
U4 U8 = CMP-04901-000007-1: as U6 on sheet mounting_circuit; ComponentLink2Description: Datasheet; Octopart: https://octopart.com/cd74hc4067m96-texas+instruments-722802; Ambient Temperature Range High: +125°C; Ipc Land Pattern Name: SOIC127P1030X265-24; Height: 2.65mm; Mouser Description: Multiplexer Switch ICs Hi-Spd CMOS 16Ch Anl Mltplxr/Demltplxr; Temperature Range Low: -55°C; Package: DW0024A; Temperature Range High: +125°C; Lead Free: Yes; ComponentLink2URL: http://www.ti.com/lit/ds/symlink/cd74hc4067.pdf; Manufacturer Part Number: CD74HC4067M96; RoHS: TRUE; Automotive: No; Device Class L1: Integrated Circuits (ICs); Digikey Description: IC MUX/DEMUX 1X16 24SOIC; Device Class L2: Logic ICs; Temperature: -55°C to +125°C; Device Class L3: Multiplexers; Category: IC; Ambient Temperature Range Low: -55°C; Number Of Outputs: 1

## Sheet mounting_circuit(4).SchDoc
size A4; SheetNumber: 5; SheetTotal: 5
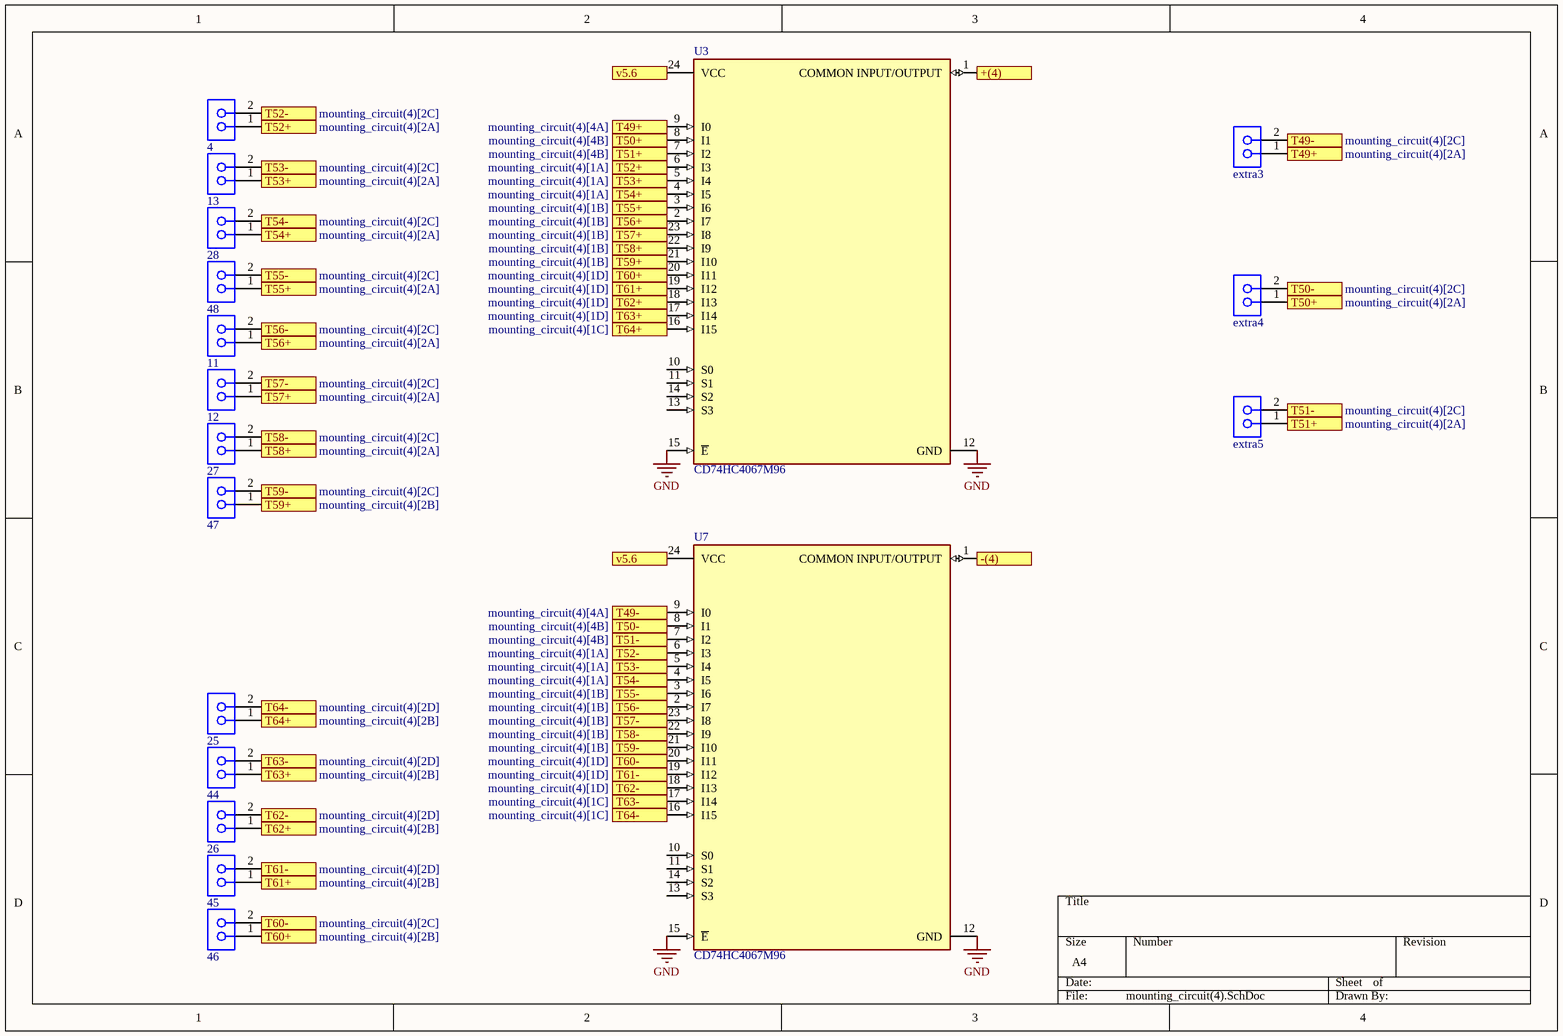
[diagram p4: mounting_circuit(4).SchDoc]

### Parts
4  Comment  [SMTC-SSW-102-02-X-S]  (value not drawn)
11  1  [SMTC-SSW-102-02-X-S]  (value not drawn)
12  Comment  [SMTC-SSW-102-02-X-S]  (value not drawn)
13  Comment  [SMTC-SSW-102-02-X-S]  (value not drawn)
25  0  [SMTC-SSW-102-02-X-S]  (value not drawn)
26  Comment  [SMTC-SSW-102-02-X-S]  (value not drawn)
27  Comment  [SMTC-SSW-102-02-X-S]  (value not drawn)
28  Comment  [SMTC-SSW-102-02-X-S]  (value not drawn)
44  0  [SMTC-SSW-102-02-X-S]  (value not drawn)
45  Comment  [SMTC-SSW-102-02-X-S]  (value not drawn)
46  Comment  [SMTC-SSW-102-02-X-S]  (value not drawn)
47  Comment  [SMTC-SSW-102-02-X-S]  (value not drawn)
48  Comment  [SMTC-SSW-102-02-X-S]  (value not drawn)
extra3  Comment  [SMTC-SSW-102-02-X-S]  (value not drawn)
extra4  Comment  [SMTC-SSW-102-02-X-S]  (value not drawn)
extra5  Comment  [SMTC-SSW-102-02-X-S]  (value not drawn)
U3  CD74HC4067M96  [FP-DW0024A-MFG]
U7  CD74HC4067M96  [FP-DW0024A-MFG]

### Ports
+(4), -(4), T49+ (see mounting_circuit(4)[2A]), T49+ (see mounting_circuit(4)[4A]), T49- (see mounting_circuit(4)[2C]), T49- (see mounting_circuit(4)[4A]), T50+ (see mounting_circuit(4)[2A]), T50+ (see mounting_circuit(4)[4B]), T50- (see mounting_circuit(4)[2C]), T50- (see mounting_circuit(4)[4B]), T51+ (see mounting_circuit(4)[2A]), T51+ (see mounting_circuit(4)[4B]), T51- (see mounting_circuit(4)[2C]), T51- (see mounting_circuit(4)[4B]), T52+ (see mounting_circuit(4)[1A]), T52+ (see mounting_circuit(4)[2A]), T52- (see mounting_circuit(4)[1A]), T52- (see mounting_circuit(4)[2C]), T53+ (see mounting_circuit(4)[1A]), T53+ (see mounting_circuit(4)[2A]), T53- (see mounting_circuit(4)[1A]), T53- (see mounting_circuit(4)[2C]), T54+ (see mounting_circuit(4)[1A]), T54+ (see mounting_circuit(4)[2A]), T54- (see mounting_circuit(4)[1A]), T54- (see mounting_circuit(4)[2C]), T55+ (see mounting_circuit(4)[1B]), T55+ (see mounting_circuit(4)[2A]), T55- (see mounting_circuit(4)[1B]), T55- (see mounting_circuit(4)[2C]), T56+ (see mounting_circuit(4)[1B]), T56+ (see mounting_circuit(4)[2A]), T56- (see mounting_circuit(4)[1B]), T56- (see mounting_circuit(4)[2C]), T57+ (see mounting_circuit(4)[1B]), T57+ (see mounting_circuit(4)[2A]), T57- (see mounting_circuit(4)[1B]), T57- (see mounting_circuit(4)[2C]), T58+ (see mounting_circuit(4)[1B]), T58+ (see mounting_circuit(4)[2A]), T58- (see mounting_circuit(4)[1B]), T58- (see mounting_circuit(4)[2C]), T59+ (see mounting_circuit(4)[1B]), T59+ (see mounting_circuit(4)[2B]), T59- (see mounting_circuit(4)[1B]), T59- (see mounting_circuit(4)[2C]), T60+ (see mounting_circuit(4)[1D]), T60+ (see mounting_circuit(4)[2B]), T60- (see mounting_circuit(4)[1D]), T60- (see mounting_circuit(4)[2C]), T61+ (see mounting_circuit(4)[1D]), T61+ (see mounting_circuit(4)[2B]), T61- (see mounting_circuit(4)[1D]), T61- (see mounting_circuit(4)[2D]), T62+ (see mounting_circuit(4)[1D]), T62+ (see mounting_circuit(4)[2B]), T62- (see mounting_circuit(4)[1D]), T62- (see mounting_circuit(4)[2D]), T63+ (see mounting_circuit(4)[1D]), T63+ (see mounting_circuit(4)[2B]), T63- (see mounting_circuit(4)[1C]), T63- (see mounting_circuit(4)[2D]), T64+ (see mounting_circuit(4)[1C]), T64+ (see mounting_circuit(4)[2B]), T64- (see mounting_circuit(4)[1C]), T64- (see mounting_circuit(4)[2D]), v5.6 (see mounting_circuit(2)[2A], mounting_circuit(2)[2C], mounting_circuit(3)[2A], mounting_circuit(3)[2C], mounting_circuit(4)[2A], mounting_circuit[1A], mounting_circuit[3A], mounting_circuit[3B]), v5.6 (see mounting_circuit(2)[2A], mounting_circuit(2)[2C], mounting_circuit(3)[2A], mounting_circuit(3)[2C], mounting_circuit(4)[2C], mounting_circuit[1A], mounting_circuit[3A], mounting_circuit[3B])

### Nets
GND: U3.12(GND) U3.15(~{E}) U7.12(GND) U7.15(~{E})
Net4_1: 4.1 U3.6(I3) ; port T52+
Net4_2: 4.2 U7.6(I3) ; port T52-
Net11_1: 11.1 U3.2(I7) ; port T56+
Net11_2: 11.2 U7.2(I7) ; port T56-
Net12_1: 12.1 U3.23(I8) ; port T57+
Net12_2: 12.2 U7.23(I8) ; port T57-
Net13_1: 13.1 U3.5(I4) ; port T53+
Net13_2: 13.2 U7.5(I4) ; port T53-
Net25_1: 25.1 U3.16(I15) ; port T64+
Net25_2: 25.2 U7.16(I15) ; port T64-
Net26_1: 26.1 U3.18(I13) ; port T62+
Net26_2: 26.2 U7.18(I13) ; port T62-
Net27_1: 27.1 U3.22(I9) ; port T58+
Net27_2: 27.2 U7.22(I9) ; port T58-
Net28_1: 28.1 U3.4(I5) ; port T54+
Net28_2: 28.2 U7.4(I5) ; port T54-
Net44_1: 44.1 U3.17(I14) ; port T63+
Net44_2: 44.2 U7.17(I14) ; port T63-
Net45_1: 45.1 U3.19(I12) ; port T61+
Net45_2: 45.2 U7.19(I12) ; port T61-
Net46_1: 46.1 U3.20(I11) ; port T60+
Net46_2: 46.2 U7.20(I11) ; port T60-
Net47_1: 47.1 U3.21(I10) ; port T59+
Net47_2: 47.2 U7.21(I10) ; port T59-
Net48_1: 48.1 U3.3(I6) ; port T55+
Net48_2: 48.2 U7.3(I6) ; port T55-
Netextra3_1: extra3.1 U3.9(I0) ; port T49+
Netextra3_2: extra3.2 U7.9(I0) ; port T49-
Netextra4_1: extra4.1 U3.8(I1) ; port T50+
Netextra4_2: extra4.2 U7.8(I1) ; port T50-
Netextra5_1: extra5.1 U3.7(I2) ; port T51+
Netextra5_2: extra5.2 U7.7(I2) ; port T51-
NetRes800_2: U3.24(VCC) U7.24(VCC) ; port v5.6
NetU3_1: U3.1(COMMON_INPUT/OUTPUT) ; port +(4)
NetU7_1: U7.1(COMMON_INPUT/OUTPUT) ; port -(4)

Not connected (* = marked no-connect by the designer): U3 10(S0) 11(S1) 13(S3) 14(S2); U7 10(S0) 11(S1) 13(S3) 14(S2)

### Library data of the parts
4 11-13 25-28 44-48 extra3-extra5 = CMP-1023-00323-1: as 1 on sheet mounting_circuit; ComponentLink3Description: Package Specification; ComponentLink2Description: Datasheet; ComponentLink1Description: Manufacturer URL; PackageVersion: CA, 6/1987; DatasheetVersion: F-214; PackageDescription: Assembly, Socket Strip .016 X .031 Tail; ComponentLink2URL: http://www.samtec.com/documents/webfiles/pdf/SSW_TH.PDF; RoHS: True; ComponentLink3URL: http://www.samtec.com/documents/webfiles/cpdf/SSW-1XX-XX-XXX-X-XX-XXX-XX-MKT.pdf; ComponentLink1URL: http://www.samtec.com; PackageReference: SSW-102-02-X-S; Mounting Technology: Through-hole; Orientation: Vertical; Temperature Range: -55 to 105 degC
U3 U7 = CMP-04901-000007-1: as U6 on sheet mounting_circuit; ComponentLink2Description: Datasheet; Octopart: https://octopart.com/cd74hc4067m96-texas+instruments-722802; Ambient Temperature Range High: +125°C; Ipc Land Pattern Name: SOIC127P1030X265-24; Height: 2.65mm; Mouser Description: Multiplexer Switch ICs Hi-Spd CMOS 16Ch Anl Mltplxr/Demltplxr; Temperature Range Low: -55°C; Package: DW0024A; Temperature Range High: +125°C; Lead Free: Yes; ComponentLink2URL: http://www.ti.com/lit/ds/symlink/cd74hc4067.pdf; Manufacturer Part Number: CD74HC4067M96; RoHS: TRUE; Automotive: No; Device Class L1: Integrated Circuits (ICs); Digikey Description: IC MUX/DEMUX 1X16 24SOIC; Device Class L2: Logic ICs; Temperature: -55°C to +125°C; Device Class L3: Multiplexers; Category: IC; Ambient Temperature Range Low: -55°C; Number Of Outputs: 1

## Nets that join several sheets
GND: circuit (9 pins), mounting_circuit (6 pins), mounting_circuit(2) (U5.12 U5.15 U9.12 U9.15), mounting_circuit(3) (U4.12 U4.15 U8.12 U8.15), mounting_circuit(4) (U3.12 U3.15 U7.12 U7.15)
VCC: circuit (6 pins), mounting_circuit (Res800.1)
NetRes800_2: mounting_circuit (5 pins), mounting_circuit(2) (U5.24 U9.24), mounting_circuit(3) (U4.24 U8.24), mounting_circuit(4) (U3.24 U7.24)
NetU4_10: mounting_circuit (U6.10 U10.10), mounting_circuit(2) (U5.10 U9.10), mounting_circuit(3) (U4.10 U8.10)
NetU4_11: mounting_circuit (U6.11 U10.11), mounting_circuit(2) (U5.11 U9.11), mounting_circuit(3) (U4.11 U8.11)
NetU4_13: mounting_circuit (U6.13 U10.13), mounting_circuit(2) (U5.13 U9.13), mounting_circuit(3) (U4.13 U8.13)
NetU4_14: mounting_circuit (U6.14 U10.14), mounting_circuit(2) (U5.14 U9.14), mounting_circuit(3) (U4.14 U8.14)